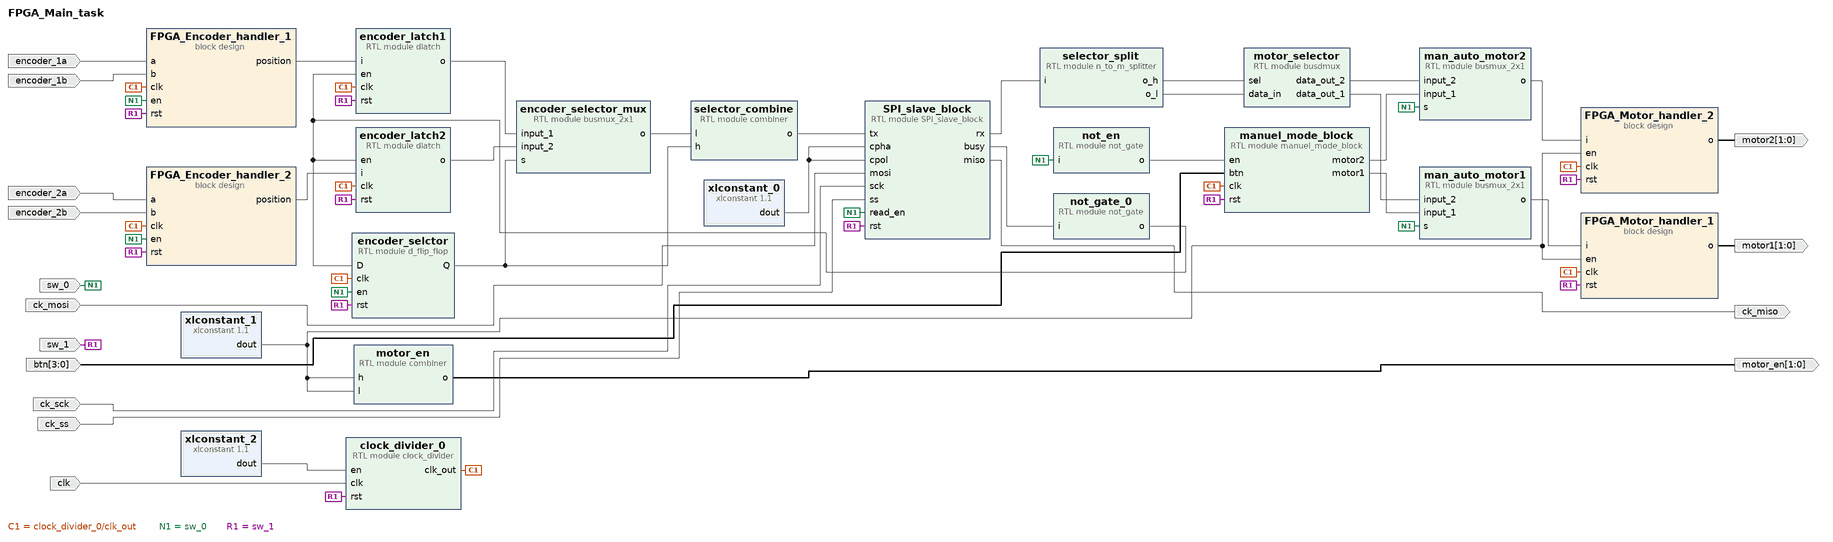
[diagram p0: block diagram of the top level]
# Vivado block design FPGA_Main_task, xc7z020clg400-1, Vivado 2024.2
create_bd_design FPGA_Main_task

create_bd_port -dir I -type clk clk
set_property -dict {CONFIG.ASSOCIATED_RESET sw_1} [get_bd_ports clk]
create_bd_port -dir I sw_0
create_bd_port -dir I -type rst sw_1
set_property -dict {CONFIG.POLARITY ACTIVE_LOW} [get_bd_ports sw_1]
create_bd_port -dir I encoder_1a
create_bd_port -dir I encoder_1b
create_bd_port -dir I encoder_2a
create_bd_port -dir I encoder_2b
create_bd_port -dir O -from 1 -to 0 motor2
create_bd_port -dir O -from 1 -to 0 motor1
create_bd_port -dir O -from 1 -to 0 motor_en
create_bd_port -dir I ck_mosi
create_bd_port -dir O ck_miso
create_bd_port -dir I -type clk ck_sck
create_bd_port -dir I ck_ss
create_bd_port -dir I -from 3 -to 0 btn

create_bd_cell -type container -reference FPGA_Encoder_handler FPGA_Encoder_handler_1
set_property -dict [list \
  CONFIG.ACTIVE_SIM_BD FPGA_Encoder_handler.bd \
  CONFIG.ACTIVE_SYNTH_BD FPGA_Encoder_handler.bd \
  CONFIG.ENABLE_DFX 0 \
  CONFIG.LIST_SIM_BD FPGA_Encoder_handler.bd \
  CONFIG.LIST_SYNTH_BD FPGA_Encoder_handler.bd \
  CONFIG.LOCK_PROPAGATE 0 \
] [get_bd_cells FPGA_Encoder_handler_1]
create_bd_cell -type container -reference FPGA_Encoder_handler FPGA_Encoder_handler_2
set_property -dict [list \
  CONFIG.ACTIVE_SIM_BD FPGA_Encoder_handler.bd \
  CONFIG.ACTIVE_SYNTH_BD FPGA_Encoder_handler.bd \
  CONFIG.ENABLE_DFX 0 \
  CONFIG.LIST_SIM_BD FPGA_Encoder_handler.bd \
  CONFIG.LIST_SYNTH_BD FPGA_Encoder_handler.bd \
  CONFIG.LOCK_PROPAGATE 0 \
] [get_bd_cells FPGA_Encoder_handler_2]
create_bd_cell -type container -reference FPGA_Motor_handler FPGA_Motor_handler_2
set_property -dict [list \
  CONFIG.ACTIVE_SIM_BD FPGA_Motor_handler.bd \
  CONFIG.ACTIVE_SYNTH_BD FPGA_Motor_handler.bd \
  CONFIG.ENABLE_DFX 0 \
  CONFIG.LIST_SIM_BD FPGA_Motor_handler.bd \
  CONFIG.LIST_SYNTH_BD FPGA_Motor_handler.bd \
  CONFIG.LOCK_PROPAGATE 0 \
] [get_bd_cells FPGA_Motor_handler_2]
create_bd_cell -type module -reference combiner motor_en
create_bd_cell -type container -reference FPGA_Motor_handler FPGA_Motor_handler_1
set_property -dict [list \
  CONFIG.ACTIVE_SIM_BD FPGA_Motor_handler.bd \
  CONFIG.ACTIVE_SYNTH_BD FPGA_Motor_handler.bd \
  CONFIG.ENABLE_DFX 0 \
  CONFIG.LIST_SIM_BD FPGA_Motor_handler.bd \
  CONFIG.LIST_SYNTH_BD FPGA_Motor_handler.bd \
  CONFIG.LOCK_PROPAGATE 0 \
] [get_bd_cells FPGA_Motor_handler_1]
create_bd_cell -type module -reference clock_divider clock_divider_0
set_property -dict {CONFIG.clock_out 1000000} [get_bd_cells clock_divider_0]
create_bd_cell -type module -reference n_to_m_splitter selector_split
set_property -dict {CONFIG.input_size 16 CONFIG.output_size_high 1 CONFIG.output_size_low 11} [get_bd_cells selector_split]
create_bd_cell -type module -reference busmux_2x1 encoder_selector_mux
set_property -dict {CONFIG.BIT_WIDTH 15} [get_bd_cells encoder_selector_mux]
create_bd_cell -type module -reference busdmux motor_selector
set_property -dict {CONFIG.BUS_WIDTH 11} [get_bd_cells motor_selector]
create_bd_cell -type module -reference SPI_slave_block SPI_slave_block
set_property -dict {CONFIG.BUS_WIDTH 16} [get_bd_cells SPI_slave_block]
create_bd_cell -type module -reference combiner selector_combine
set_property -dict {CONFIG.lowbits 15} [get_bd_cells selector_combine]
create_bd_cell -type module -reference d_flip_flop encoder_selctor
create_bd_cell -type module -reference not_gate not_gate_0
create_bd_cell -type module -reference dlatch encoder_latch1
set_property -dict {CONFIG.WIDTH 15} [get_bd_cells encoder_latch1]
create_bd_cell -type module -reference dlatch encoder_latch2
set_property -dict {CONFIG.WIDTH 15} [get_bd_cells encoder_latch2]
create_bd_cell -type ip -vlnv xilinx.com:ip:xlconstant:1.1 xlconstant_0
set_property -dict {CONFIG.CONST_VAL 0} [get_bd_cells xlconstant_0]
create_bd_cell -type module -reference busmux_2x1 man_auto_motor1
set_property -dict {CONFIG.BIT_WIDTH 11} [get_bd_cells man_auto_motor1]
create_bd_cell -type ip -vlnv xilinx.com:ip:xlconstant:1.1 xlconstant_1
create_bd_cell -type module -reference busmux_2x1 man_auto_motor2
set_property -dict {CONFIG.BIT_WIDTH 11} [get_bd_cells man_auto_motor2]
create_bd_cell -type module -reference manuel_mode_block manuel_mode_block
create_bd_cell -type module -reference not_gate not_en
create_bd_cell -type ip -vlnv xilinx.com:ip:xlconstant:1.1 xlconstant_2

# ---- connections ----

connect_bd_net [get_bd_pins FPGA_Encoder_handler_1/position] [get_bd_pins encoder_latch1/i]
connect_bd_net [get_bd_pins FPGA_Encoder_handler_2/position] [get_bd_pins encoder_latch2/i]
connect_bd_net -net FPGA_Motor_handler_0_o [get_bd_pins FPGA_Motor_handler_2/o] [get_bd_ports motor2]
connect_bd_net [get_bd_pins FPGA_Motor_handler_1/o] [get_bd_ports motor1]
connect_bd_net -net SPI_slave_block_0_busy [get_bd_pins SPI_slave_block/busy] [get_bd_pins not_gate_0/i]
connect_bd_net -net SPI_slave_block_0_miso [get_bd_pins SPI_slave_block/miso] [get_bd_ports ck_miso]
connect_bd_net -net SPI_slave_block_0_rx [get_bd_pins SPI_slave_block/rx] [get_bd_pins selector_split/i]
connect_bd_net -net a_0_1 [get_bd_ports encoder_1a] [get_bd_pins FPGA_Encoder_handler_1/a]
connect_bd_net -net a_1_1 [get_bd_ports encoder_2a] [get_bd_pins FPGA_Encoder_handler_2/a]
connect_bd_net -net b_0_1 [get_bd_ports encoder_1b] [get_bd_pins FPGA_Encoder_handler_1/b]
connect_bd_net -net b_1_1 [get_bd_ports encoder_2b] [get_bd_pins FPGA_Encoder_handler_2/b]
connect_bd_net -net btn_0_1 [get_bd_ports btn] [get_bd_pins manuel_mode_block/btn]
connect_bd_net -net busdmux_0_data_out_1 [get_bd_pins motor_selector/data_out_1] [get_bd_pins man_auto_motor1/input_2]
connect_bd_net -net busdmux_0_data_out_2 [get_bd_pins motor_selector/data_out_2] [get_bd_pins man_auto_motor2/input_2]
connect_bd_net -net busmux_2x1_0_o [get_bd_pins man_auto_motor1/o] [get_bd_pins FPGA_Motor_handler_1/i]
connect_bd_net -net busmux_2x1_1_o [get_bd_pins encoder_selector_mux/o] [get_bd_pins selector_combine/l]
connect_bd_net [get_bd_ports ck_mosi] [get_bd_pins SPI_slave_block/mosi]
connect_bd_net [get_bd_ports ck_sck] [get_bd_pins SPI_slave_block/sck]
connect_bd_net -net clk_0_1 [get_bd_pins clock_divider_0/clk_out] \
  [get_bd_pins FPGA_Encoder_handler_1/clk] [get_bd_pins FPGA_Encoder_handler_2/clk] [get_bd_pins FPGA_Motor_handler_2/clk] \
  [get_bd_pins FPGA_Motor_handler_1/clk] [get_bd_pins encoder_selctor/clk] [get_bd_pins encoder_latch2/clk] \
  [get_bd_pins encoder_latch1/clk] [get_bd_pins manuel_mode_block/clk]
connect_bd_net [get_bd_ports clk] [get_bd_pins clock_divider_0/clk]
connect_bd_net -net combiner_0_o [get_bd_pins motor_en/o] [get_bd_ports motor_en]
connect_bd_net -net combiner_1_o [get_bd_pins selector_combine/o] [get_bd_pins SPI_slave_block/tx]
connect_bd_net -net d_flip_flop_0_Q [get_bd_pins encoder_selctor/Q] [get_bd_pins encoder_selector_mux/s] [get_bd_pins selector_combine/h]
connect_bd_net -net dlatch_0_o [get_bd_pins encoder_latch1/o] [get_bd_pins encoder_selector_mux/input_1]
connect_bd_net -net dlatch_1_o [get_bd_pins encoder_latch2/o] [get_bd_pins encoder_selector_mux/input_2]
connect_bd_net -net en_0_1 [get_bd_ports sw_0] \
  [get_bd_pins FPGA_Encoder_handler_1/en] [get_bd_pins FPGA_Encoder_handler_2/en] [get_bd_pins encoder_selctor/en] \
  [get_bd_pins SPI_slave_block/read_en] [get_bd_pins man_auto_motor1/s] [get_bd_pins man_auto_motor2/s] \
  [get_bd_pins not_en/i]
connect_bd_net [get_bd_pins man_auto_motor2/o] [get_bd_pins FPGA_Motor_handler_2/i]
connect_bd_net -net manuel_mode_block_0_motor1 [get_bd_pins manuel_mode_block/motor1] [get_bd_pins man_auto_motor1/input_1]
connect_bd_net -net manuel_mode_block_0_motor2 [get_bd_pins manuel_mode_block/motor2] [get_bd_pins man_auto_motor2/input_1]
connect_bd_net -net n_to_m_splitter_1_o_h [get_bd_pins selector_split/o_h] [get_bd_pins motor_selector/sel]
connect_bd_net -net n_to_m_splitter_1_o_l [get_bd_pins selector_split/o_l] [get_bd_pins motor_selector/data_in]
connect_bd_net [get_bd_pins not_gate_0/o] [get_bd_pins encoder_selctor/D] [get_bd_pins encoder_latch2/en] [get_bd_pins encoder_latch1/en]
connect_bd_net -net not_gate_1_o [get_bd_pins not_en/o] [get_bd_pins manuel_mode_block/en]
connect_bd_net -net rst_0_1 [get_bd_ports sw_1] \
  [get_bd_pins FPGA_Encoder_handler_1/rst] [get_bd_pins FPGA_Encoder_handler_2/rst] [get_bd_pins FPGA_Motor_handler_2/rst] \
  [get_bd_pins FPGA_Motor_handler_1/rst] [get_bd_pins SPI_slave_block/rst] [get_bd_pins encoder_selctor/rst] \
  [get_bd_pins encoder_latch2/rst] [get_bd_pins encoder_latch1/rst] [get_bd_pins clock_divider_0/rst] \
  [get_bd_pins manuel_mode_block/rst]
connect_bd_net -net ss_0_1 [get_bd_ports ck_ss] [get_bd_pins SPI_slave_block/ss]
connect_bd_net [get_bd_pins xlconstant_0/dout] [get_bd_pins SPI_slave_block/cpha] [get_bd_pins SPI_slave_block/cpol]
connect_bd_net [get_bd_pins xlconstant_1/dout] \
  [get_bd_pins motor_en/h] [get_bd_pins motor_en/l] [get_bd_pins FPGA_Motor_handler_2/en] \
  [get_bd_pins FPGA_Motor_handler_1/en]
connect_bd_net [get_bd_pins xlconstant_2/dout] [get_bd_pins clock_divider_0/en]

validate_bd_design
save_bd_design
